# Altium schematic sheet SSTR.SchDoc
size A4
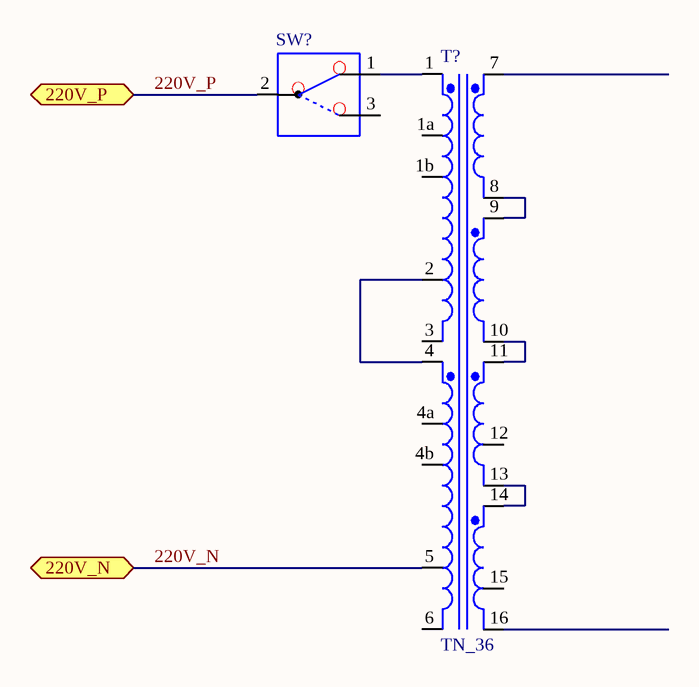
[diagram p0: SSTR.SchDoc]

## Parts
SW?  Sw  [SW_SPDT_B]  (value not drawn)
T?  TN_36  [TRF_8]

## Ports
220V_N, 220V_P

## Nets
GND: SW?.4(GND) SW?.5(GND)
220V_N: T?.5 ; port 220V_N
220V_P: SW?.2 ; port 220V_P
NetSW?_1: SW?.1 T?.1
NetT?_2: T?.2 T?.4
NetT?_8: T?.8 T?.9
NetT?_10: T?.10 T?.11
NetT?_13: T?.13 T?.14

Not connected (* = marked no-connect by the designer): SW? 3; T? 1a 1b 3 4a 4b 6 7 12 15 16

## Library data of the parts
SW? = SW_PWR_ET01J6ABE2: SWITCH ROCKER SPDT .4VA RT ANGLE; Vendor: MOLEX; Spec: C&K ET Series.pdf; Digi-Key Part Number: CKN2077-ND; Lead Free Status: Lead free; RoHS Status: RoHS compliant; Part_Number: ET01J6ABE2
T? = TN_36: TN 36